# Altium schematic sheet PMUIO_BLOCK.SchDoc: OSC/PMU Controller
size A4; DrawnBy: ThanhQuoc; Revision: V01; SheetNumber: 6; SheetTotal: 21; Project: RV1126 CAMERA BOARD DESIGN
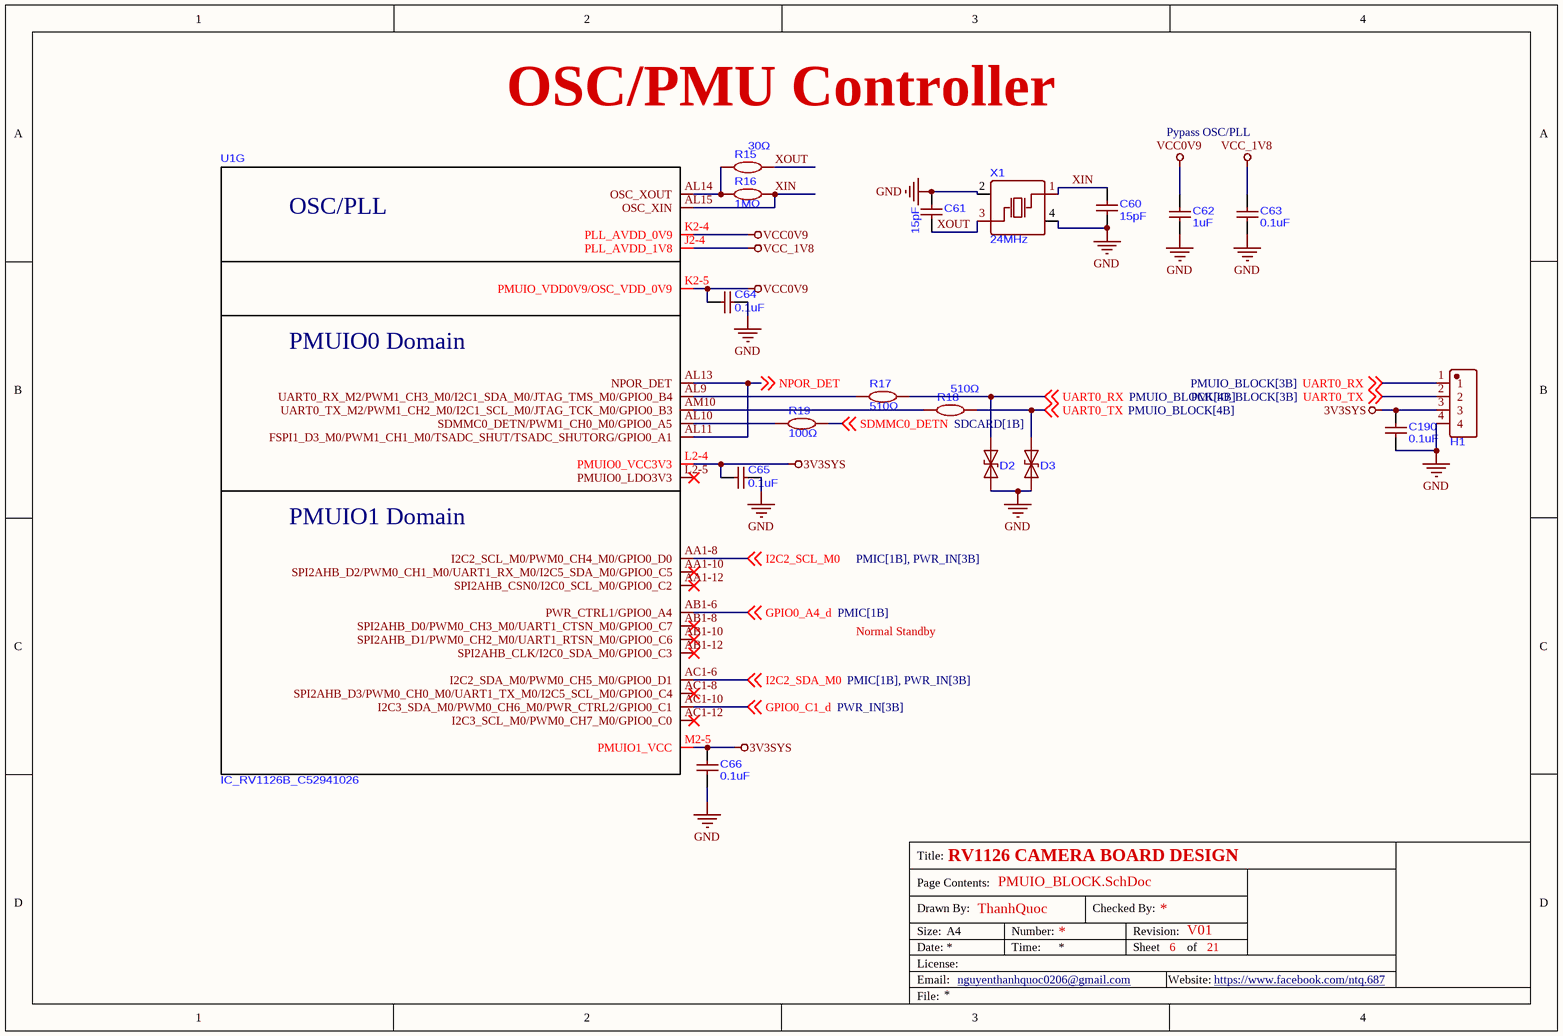
[diagram p0: PMUIO_BLOCK.SchDoc]

## Parts
C60  15pF  [C0201]
C61  15pF  [C0201]
C62  1uF  [C0201]
C63  0.1uF  [C0201]
C64  0.1uF  [C0201]
C65  0.1uF  [C0201]
C66  0.1uF  [C0201]
C190  0.1uF  [C0201]
D2  ESD DIODE  [DSN0603-2_L0.7-W0.3-P0.40-BI]  (value not drawn)
D3  ESD DIODE  [DSN0603-2_L0.7-W0.3-P0.40-BI]  (value not drawn)
H1  Through Hole,P=1.27mm  [HDR-TH_4P-P1.27-V-M]  (value not drawn)
R15  30Ω  [R0201]
R16  1MΩ  [R0201]
R17  510Ω  [R0201]
R18  510Ω  [R0201]
R19  100Ω  [R0201]
U1  IC_RV1126B_C52941026  [CCSP-491_L14.0-W14.0-TL_RV1126B]  (part G of 18)
X1  24MHz  [CRYSTAL-SMD_4P-L2.0-W1.6-BL]

## Nets
3V3SYS: C65.2 C66.2 C190.2 H1.3 U1.L2-4(PMUIO0_VCC3V3) U1.M2-5(PMUIO1_VCC)
GND: C60.1 C61.2 C62.1 C63.1 C64.1 C65.1 C66.1 C190.1 D2.1(K) D3.1(K) H1.4 X1.2(GND) X1.4(GND)
VCC0V9: C62.2 C64.2 U1.K2-4(PLL_AVDD_0V9) U1.K2-5(PMUIO_VDD0V9/OSC_VDD_0V9)
VCC_1V8: C63.2 U1.J2-4(PLL_AVDD_1V8)
GPIO0_A4_d: U1.AB1-6(PWR_CTRL1/GPIO0_A4) ; off-sheet GPIO0_A4_d
GPIO0_C1_d: U1.AC1-10(I2C3_SDA_M0/PWM0_CH6_M0/PWR_CTRL2/GPIO0_C1) ; off-sheet GPIO0_C1_d
I2C2_SCL_M0: U1.AA1-8(I2C2_SCL_M0/PWM0_CH4_M0/GPIO0_D0) ; off-sheet I2C2_SCL_M0
I2C2_SDA_M0: U1.AC1-6(I2C2_SDA_M0/PWM0_CH5_M0/GPIO0_D1) ; off-sheet I2C2_SDA_M0
NPOR_DET: U1.AL11(FSPI1_D3_M0/PWM1_CH1_M0/TSADC_SHUT/TSADC_SHUTORG/GPIO0_A1) U1.AL13(NPOR_DET) ; off-sheet NPOR_DET
SDMMC0_DETN: R19.2 ; off-sheet SDMMC0_DETN
UART0_RX: D2.2(A) H1.1 R17.2 ; off-sheet UART0_RX
UART0_TX: D3.2(A) H1.2 R18.2 ; off-sheet UART0_TX
XIN: C60.2 R16.2 U1.AL15(OSC_XIN) X1.1(OSC1)
XOUT: C61.1 R15.2 X1.3(OSC2)
NetR15_1: R15.1 R16.1 U1.AL14(OSC_XOUT)
NetR17_1: R17.1 U1.AL9(UART0_RX_M2/PWM1_CH3_M0/I2C1_SDA_M0/JTAG_TMS_M0/GPIO0_B4)
NetR18_1: R18.1 U1.AM10(UART0_TX_M2/PWM1_CH2_M0/I2C1_SCL_M0/JTAG_TCK_M0/GPIO0_B3)
NetR19_1: R19.1 U1.AL10(SDMMC0_DETN/PWM1_CH0_M0/GPIO0_A5)

Not connected (* = marked no-connect by the designer): U1 AA1-10(SPI2AHB_D2/PWM0_CH1_M0/UART1_RX_M0/I2C5_SDA_M0/GPIO0_C5)* AA1-12(SPI2AHB_CSN0/I2C0_SCL_M0/GPIO0_C2)* AB1-8(SPI2AHB_D0/PWM0_CH3_M0/UART1_CTSN_M0/GPIO0_C7)* AB1-10(SPI2AHB_D1/PWM0_CH2_M0/UART1_RTSN_M0/GPIO0_C6)* AB1-12(SPI2AHB_CLK/I2C0_SDA_M0/GPIO0_C3)* AC1-8(SPI2AHB_D3/PWM0_CH0_M0/UART1_TX_M0/I2C5_SCL_M0/GPIO0_C4)* AC1-12(I2C3_SCL_M0/PWM0_CH7_M0/GPIO0_C0)* L2-5(PMUIO0_LDO3V3)*

## Notes on the sheet
- Pypass OSC/PLL
- Normal Standby
- Title:
- Drawn By:
- Page Contents:
- Checked By:
- Size:
- Date:
- File:
- License:
- Email:
- A4
- nguyenthanhquoc0206@gmail.com
- Number:
- Time:
- Revision:
- Sheet
- Website:
- of
- https://www.facebook.com/ntq.687
- (in symbol IC_RV1126B_C52941026, part G) OSC/PLL; PMUIO0 Domain; PMUIO1 Domain

## Library data of the parts
C60 C61 = CAP_15pF-25V-5%-0201: CAP CER 15pF 50V NP0 0201; ComponentLink1Description: LCSC; ComponentLink1URL: https://www.lcsc.com/product-detail/C277480.html?s_z=n_q_t_15PF&spm=wm.fly.bg.0.xh___wm.ssy.tc.0.tz&lcsc_vid=EwRWBFZSQVIPVFdUTlJfVldeFFRYUFQAElRYBFRRE1MxVlNeRFdcX11TTlBaVjsOAxUeFF5JWBYZEEoKFBINSQcJGk4NBhADEA4cHktXRlRZSQwSGg0%3D
C62 = CAP_1uF-6.3V-10%-0201: 1uF ±10% 6.3V Ceramic Capacitor X5R 0201
C63-C66 C190 = CAP_100nF-6.3V-10%-0201_1: 0.1uF ±10% 6.3V Ceramic Capacitor X5R 0201
D2 D3 = PESD5V0H1BSFYL: ESD DIODE 5VWM 5VC DSN0603-2 0.13PF
H1 = PZ127V-11-04-0720: Through Hole -40℃~+105℃ 2P 1A 4.3mm 1x2P 1.27mm Top 1 Square Hole Through Hole,P=1.27mm Headers, Receptacles, Female Sockets RoHS
R15 = RES_30Ω-0.05W-1%-0201: RES 30Ω ±1% 50mW 0201; ComponentLink1Description: LCSC; ComponentLink1URL: https://www.lcsc.com/product-detail/C320826.html?spm=wm.fly.bg.3.xh&lcsc_vid=EwRWBFZSQVIPVFdUTlJfVldeFFRYUFQAElRYBFRRE1MxVlNeRFdcXlNfT1JZVDsOAxUeFF5JWBYZEEoKFBINSQcJGk4eFQsCAgIaSgADAwAHC0slRlRbUFBVWQkaCgg%3D
R16 = RES_1M-0.1W-5%-0201: RES 1MΩ ±5% 50mW 0201; ComponentLink1Description: LCSC; ComponentLink1URL: https://www.lcsc.com/product-detail/C93949.html?spm=wm.fly.bg.0.xh&lcsc_vid=EwRWBFZSQVIPVFdUTlJfVldeFFRYUFQAElRYBFRRE1MxVlNeRVlXUFNQQ1RWXjsOAxUeFF5JWBYZEEoKFBINSQcJGk4eFQsCAgIaSgADAwAHC0slRlVYUFFIHxUDCw%3D%3D
R17 R18 = RES_510-0.05W-1%-0201: 510Ω 50mW 25V Thick Film Resistor ±200ppm/℃ ±1% 0201 Chip Resistor - Surface Mount RoHS
R19 = RES_100OHM-50mW-1%-0201: RES 100Ω ±1% 50mW 0201
X1 = XTAL_24Mhz-12pF-4-SMD: CRYSTAL 24MHz 12pF SMD; ComponentLink1Description: LCSC; ComponentLink1URL: https://www.lcsc.com/product-detail/C37635324.html?spm=wm.fly.bg.3.xh&lcsc_vid=EwRWBFZSQVIPVFdUTlJfVldeFFRYUFQAElRYBFRRE1MxVlNeRFdcUVxRR1BcVjsOAxUeFF5JWBYZEEoKFBINSQcJGk4eFQsCAgIaSgADAwAHC0slRVlaVlJXWQkaCgg%3D